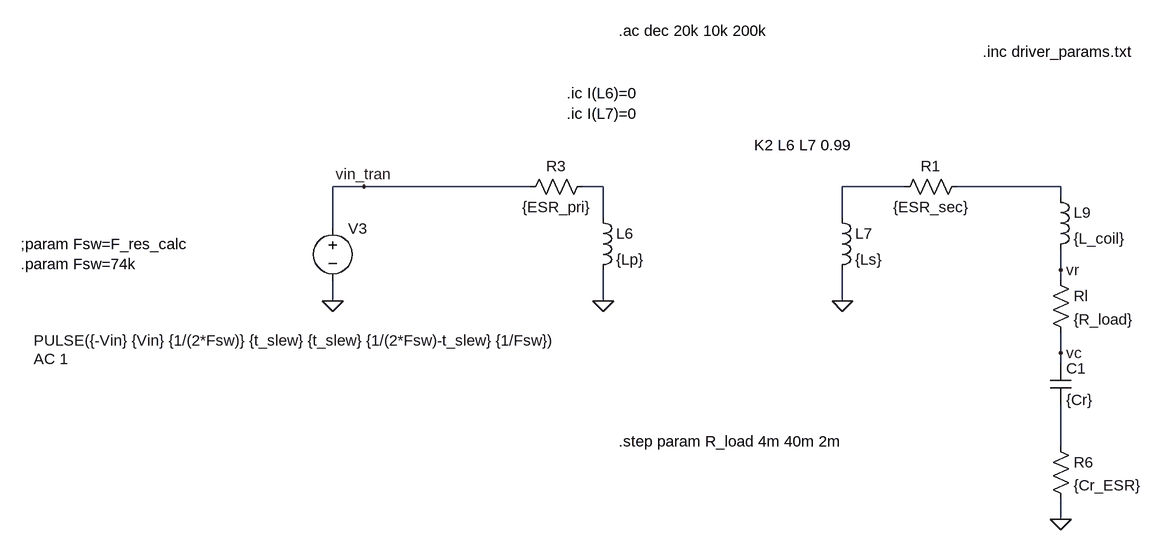
[diagram p0: schematic res_driver_ac.asc]
res_driver_ac.asc, the LTspice schematic file:
Version 4.1
SHEET 1 2284 2116
WIRE -400 704 -448 704
WIRE -144 704 -400 704
WIRE -32 704 -64 704
WIRE 432 704 336 704
WIRE 672 704 512 704
WIRE 672 720 672 704
WIRE -32 752 -32 704
WIRE 336 752 336 704
WIRE -448 768 -448 704
WIRE 672 832 672 800
WIRE 672 848 672 832
WIRE -448 880 -448 848
WIRE -32 880 -32 832
WIRE 336 880 336 832
WIRE 672 960 672 928
WIRE 672 976 672 960
WIRE 672 1104 672 1040
WIRE 672 1216 672 1184
FLAG 336 880 0
FLAG -448 880 0
FLAG -400 704 vin_tran
FLAG 672 1216 0
FLAG -32 880 0
FLAG 672 960 vc
FLAG 672 832 vr
SYMBOL ind -48 736 R0
SYMATTR InstName L6
SYMATTR Value {Lp}
SYMBOL ind 320 736 R0
SYMATTR InstName L7
SYMATTR Value {Ls}
SYMBOL res -160 720 R270
WINDOW 0 32 56 VTop 2
WINDOW 3 0 56 VBottom 2
SYMATTR InstName R3
SYMATTR Value {ESR_pri}
SYMBOL voltage -448 752 R0
WINDOW 123 -460 217 Left 2
WINDOW 39 0 0 Left 0
WINDOW 3 -460 189 Left 2
SYMATTR Value2 AC 1
SYMATTR Value PULSE({-Vin} {Vin} {1/(2*Fsw)} {t_slew} {t_slew} {1/(2*Fsw)-t_slew} {1/Fsw})
SYMATTR InstName V3
SYMBOL res 656 832 R0
SYMATTR InstName Rl
SYMATTR Value {R_load}
SYMBOL ind 656 704 R0
SYMATTR InstName L9
SYMATTR Value {L_coil}
SYMBOL cap 656 976 R0
SYMATTR InstName C1
SYMATTR Value {Cr}
SYMBOL res 656 1088 R0
SYMATTR InstName R6
SYMATTR Value {Cr_ESR}
SYMBOL res 528 688 R90
WINDOW 0 0 56 VBottom 2
WINDOW 3 32 56 VTop 2
SYMATTR InstName R1
SYMATTR Value {ESR_sec}
TEXT -8 464 Left 2 !.ac dec 20k 10k 200k
TEXT 200 640 Left 2 !K2 L6 L7 0.99
TEXT -88 560 Left 2 !.ic I(L6)=0\n.ic I(L7)=0
TEXT 552 496 Left 2 !.inc driver_params.txt
TEXT -928 792 Left 2 !;param Fsw=F_res_calc\n.param Fsw=74k
TEXT -8 1096 Left 2 !.step param R_load 4m 40m 2m

The netlist it stands for:
* res_driver_ac.asc
L6 N001 0 {Lp}
L7 N002 0 {Ls}
R3 vin_tran N001 {ESR_pri}
V3 vin_tran 0 PULSE({-Vin} {Vin} {1/(2*Fsw)} {t_slew} {t_slew} {1/(2*Fsw)-t_slew} {1/Fsw}) AC 1
Rl vr vc {R_load}
L9 N003 vr {L_coil}
C1 vc N004 {Cr}
R6 N004 0 {Cr_ESR}
R1 N003 N002 {ESR_sec}
.ac dec 20k 10k 200k
K2 L6 L7 0.99
.ic I(L6)=0
.ic I(L7)=0
.inc driver_params.txt
;param Fsw=F_res_calc
.param Fsw=74k
.step param R_load 4m 40m 2m
.backanno
.end